# Altium schematic sheet Sheet1.SchDoc
size A3
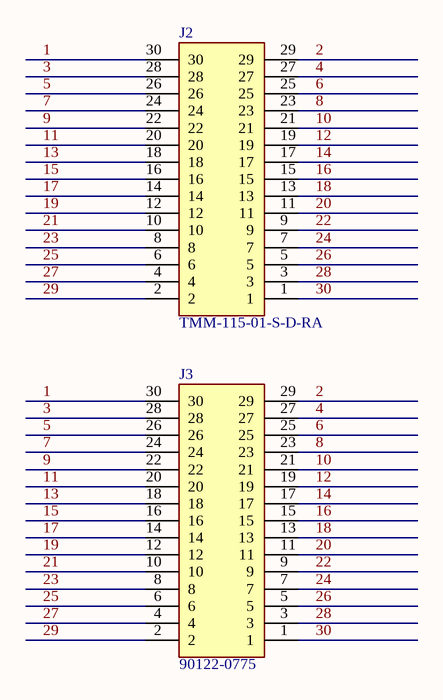
[diagram p0: Sheet1.SchDoc]

## Parts
J2  TMM-115-01-S-D-RA  [TMM11501SDRA]
J3  90122-0775  [HDRRA30W65P254_2X15_3802X250X635P]

## Nets
1: J2.30 J3.30
2: J2.29 J3.29
3: J2.28 J3.28
4: J2.27 J3.27
5: J2.26 J3.26
6: J2.25 J3.25
7: J2.24 J3.24
8: J2.23 J3.23
9: J2.22 J3.22
10: J2.21 J3.21
11: J2.20 J3.20
12: J2.19 J3.19
13: J2.18 J3.18
14: J2.17 J3.17
15: J2.16 J3.16
16: J2.15 J3.15
17: J2.14 J3.14
18: J2.13 J3.13
19: J2.12 J3.12
20: J2.11 J3.11
21: J2.10 J3.10
22: J2.9 J3.9
23: J2.8 J3.8
24: J2.7 J3.7
25: J2.6 J3.6
26: J2.5 J3.5
27: J2.4 J3.4
28: J2.3 J3.3
29: J2.2 J3.2
30: J2.1 J3.1

## Library data of the parts
J2 = TMM-115-01-S-D-RA: Connector; Manufacturer_Name: SAMTEC; Datasheet Link: https://componentsearchengine.com/Datasheets/1/TMM-115-01-S-D-RA.pdf; Height: 3.94mm; Manufacturer_Part_Number: TMM-115-01-S-D-RA; Mouser Part Number: 200-TMM11501SDRA; Mouser Price/Stock: https://www.mouser.com/Search/Refine.aspx?Keyword=200-TMM11501SDRA
J3 = 90122-0775: Connector; Manufacturer_Name: Molex; Datasheet Link: https://rs.componentsearchengine.com/Datasheets/2/90122-0775.pdf; Height: 6.35mm; Manufacturer_Part_Number: 90122-0775; Mouser Part Number: 538-90122-0775; Mouser Price/Stock: https://www.mouser.co.uk/ProductDetail/Molex/90122-0775?qs=kEwmkoUtv7Q3b9FUL9Noug%3D%3D